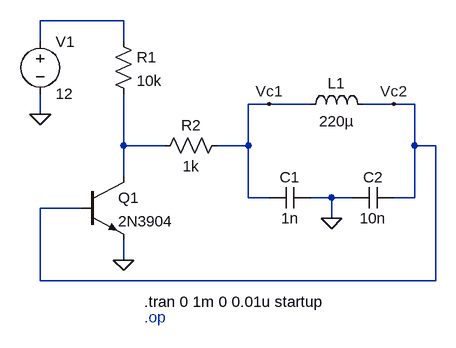
[diagram p0: schematic basic_colpitts_falstad_amplifier_feedback.asc]
basic_colpitts_falstad_amplifier_feedback.asc, the LTspice schematic file:
Version 4
SHEET 1 1220 680
WIRE 592 -256 464 -256
WIRE 464 -224 464 -256
WIRE 592 -224 592 -256
WIRE 816 -128 784 -128
WIRE 880 -128 816 -128
WIRE 1008 -128 960 -128
WIRE 1040 -128 1008 -128
WIRE 464 -112 464 -144
WIRE 592 -64 592 -144
WIRE 656 -64 592 -64
WIRE 784 -64 784 -128
WIRE 784 -64 736 -64
WIRE 1040 -64 1040 -128
WIRE 1072 -64 1040 -64
WIRE 592 -16 592 -64
WIRE 784 16 784 -64
WIRE 816 16 784 16
WIRE 912 16 880 16
WIRE 944 16 912 16
WIRE 1040 16 1040 -64
WIRE 1040 16 1008 16
WIRE 528 32 464 32
WIRE 912 48 912 16
WIRE 592 112 592 80
WIRE 464 144 464 32
WIRE 1072 144 1072 -64
WIRE 1072 144 464 144
FLAG 592 112 0
FLAG 464 -112 0
FLAG 816 -128 Vc1
FLAG 1008 -128 Vc2
FLAG 912 48 0
SYMBOL cap 816 32 R270
WINDOW 0 32 32 VTop 2
WINDOW 3 0 32 VBottom 2
SYMATTR InstName C1
SYMATTR Value 1n
SYMBOL cap 1008 0 R90
WINDOW 0 0 32 VBottom 2
WINDOW 3 32 32 VTop 2
SYMATTR InstName C2
SYMATTR Value 10n
SYMBOL ind 864 -112 R270
WINDOW 0 32 56 VTop 2
WINDOW 3 5 56 VBottom 2
SYMATTR InstName L1
SYMATTR Value 220µ
SYMBOL npn 528 -16 R0
SYMATTR InstName Q1
SYMATTR Value 2N3904
SYMBOL res 576 -240 R0
SYMATTR InstName R1
SYMATTR Value 10k
SYMBOL voltage 464 -240 R0
WINDOW 123 0 0 Left 0
WINDOW 39 0 0 Left 0
SYMATTR InstName V1
SYMATTR Value 12
SYMBOL res 640 -48 R270
WINDOW 0 32 56 VTop 2
WINDOW 3 0 56 VBottom 2
SYMATTR InstName R2
SYMATTR Value 1k
TEXT 624 176 Left 2 !.tran 0 1m 0 0.01u startup
TEXT 624 200 Left 2 ;.op

The netlist it stands for:
* basic_colpitts_falstad_amplifier_feedback.asc
C1 Vc1 0 1n
C2 Vc2 0 10n
L1 Vc1 Vc2 220µ
Q1 N002 Vc2 0 0 2N3904
R1 N001 N002 10k
V1 N001 0 12
R2 N002 Vc1 1k
.model NPN NPN
.model PNP PNP
.lib standard.bjt
.tran 0 1m 0 0.01u startup
* .op
.backanno
.end